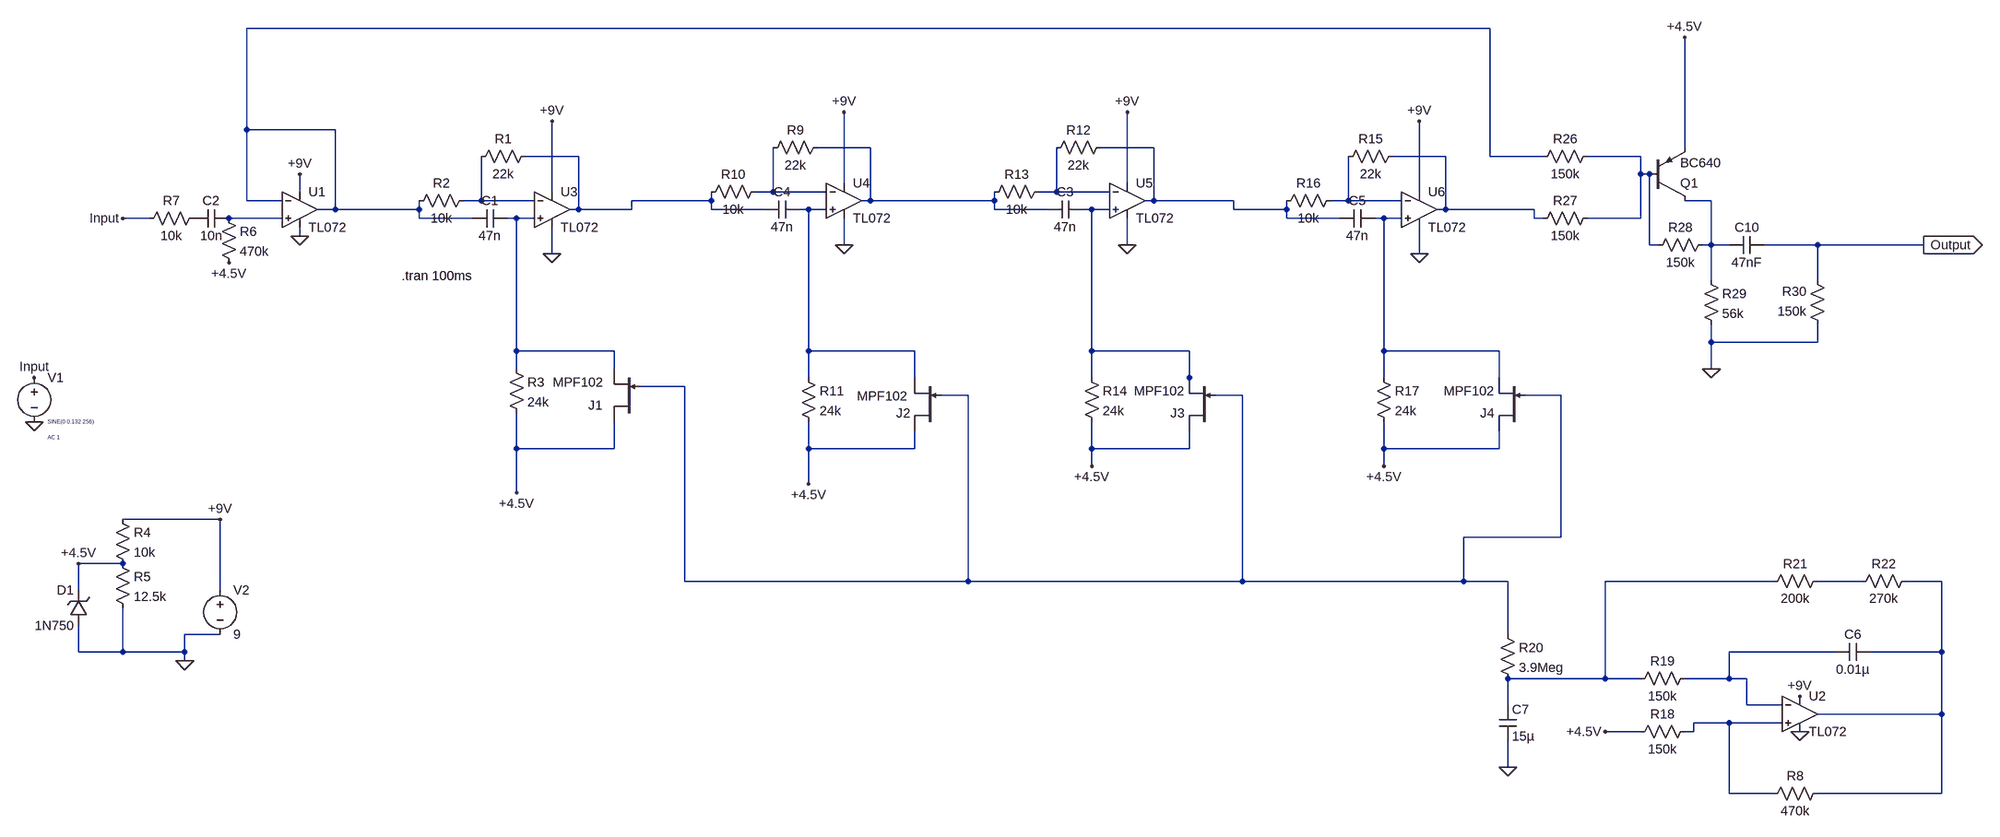
[diagram p0: schematic Phaser.asc]
Phaser.asc, the LTspice schematic file:
Version 4
SHEET 1 3668 1460
WIRE 1824 -176 -464 -176
WIRE -464 16 -464 -176
WIRE -304 16 -464 16
WIRE 704 48 608 48
WIRE 1216 48 1120 48
WIRE 2176 48 2176 -160
WIRE 176 64 80 64
WIRE 1744 64 1648 64
WIRE 1824 64 1824 -176
WIRE 1920 64 1824 64
WIRE 2096 64 2000 64
WIRE 2096 96 2096 64
WIRE 2112 96 2096 96
WIRE 656 112 656 -16
WIRE 1168 112 1168 -16
WIRE -368 128 -368 96
WIRE 128 128 128 0
WIRE 528 128 528 48
WIRE 528 128 496 128
WIRE 624 128 528 128
WIRE 1040 128 1040 48
WIRE 1040 128 1008 128
WIRE 1136 128 1040 128
WIRE 1696 128 1696 0
WIRE -464 144 -464 16
WIRE -400 144 -464 144
WIRE 0 144 0 64
WIRE 0 144 -32 144
WIRE 96 144 0 144
WIRE 416 144 416 128
WIRE 416 144 272 144
WIRE 704 144 704 48
WIRE 704 144 688 144
WIRE 928 144 928 128
WIRE 928 144 704 144
WIRE 1216 144 1216 48
WIRE 1216 144 1200 144
WIRE 1360 144 1216 144
WIRE 1568 144 1568 64
WIRE 1568 144 1536 144
WIRE 1664 144 1568 144
WIRE 2224 144 2176 144
WIRE -304 160 -304 16
WIRE -304 160 -336 160
WIRE -112 160 -112 144
WIRE -112 160 -304 160
WIRE 176 160 176 64
WIRE 176 160 160 160
WIRE 272 160 272 144
WIRE 272 160 176 160
WIRE 416 160 416 144
WIRE 512 160 416 160
WIRE 592 160 576 160
WIRE 624 160 592 160
WIRE 928 160 928 144
WIRE 1024 160 928 160
WIRE 1104 160 1088 160
WIRE 1136 160 1104 160
WIRE 1360 160 1360 144
WIRE 1456 160 1456 144
WIRE 1456 160 1360 160
WIRE 1744 160 1744 64
WIRE 1744 160 1728 160
WIRE 1904 160 1744 160
WIRE -640 176 -688 176
WIRE -400 176 -496 176
WIRE -112 176 -112 160
WIRE -16 176 -112 176
WIRE 64 176 48 176
WIRE 96 176 64 176
WIRE 1456 176 1456 160
WIRE 1552 176 1456 176
WIRE 1632 176 1616 176
WIRE 1664 176 1632 176
WIRE 1904 176 1904 160
WIRE 1920 176 1904 176
WIRE 2096 176 2096 96
WIRE 2096 176 2000 176
WIRE -368 208 -368 192
WIRE 656 224 656 176
WIRE 1168 224 1168 176
WIRE 2112 224 2112 96
WIRE 2128 224 2112 224
WIRE 2224 224 2224 144
WIRE 2224 224 2208 224
WIRE 2256 224 2224 224
WIRE 2416 224 2320 224
WIRE 2608 224 2416 224
WIRE 128 240 128 192
WIRE 1696 240 1696 192
WIRE 2224 288 2224 224
WIRE 2416 288 2416 224
WIRE 2224 400 2224 368
WIRE 2416 400 2416 368
WIRE 2416 400 2224 400
WIRE 64 416 64 176
WIRE 240 416 64 416
WIRE 592 416 592 160
WIRE 784 416 592 416
WIRE 1104 416 1104 160
WIRE 1280 416 1104 416
WIRE 1632 416 1632 176
WIRE 1840 416 1632 416
WIRE 64 448 64 416
WIRE 240 448 240 416
WIRE 2224 448 2224 400
WIRE 592 464 592 416
WIRE 784 464 784 416
WIRE 1104 464 1104 416
WIRE 1280 464 1280 416
WIRE 1632 464 1632 416
WIRE 1840 464 1840 416
WIRE 368 480 288 480
WIRE 1280 480 1280 464
WIRE 880 496 832 496
WIRE 1376 496 1328 496
WIRE 1952 496 1888 496
WIRE 64 592 64 528
WIRE 240 592 240 544
WIRE 240 592 64 592
WIRE 592 592 592 544
WIRE 784 592 784 560
WIRE 784 592 592 592
WIRE 1104 592 1104 544
WIRE 1280 592 1280 560
WIRE 1280 592 1104 592
WIRE 1632 592 1632 544
WIRE 1840 592 1840 560
WIRE 1840 592 1632 592
WIRE 1104 624 1104 592
WIRE 1632 624 1632 592
WIRE 592 656 592 592
WIRE 64 672 64 592
WIRE -512 720 -688 720
WIRE 1952 752 1952 496
WIRE 1952 752 1776 752
WIRE -688 800 -768 800
WIRE 368 832 368 480
WIRE 880 832 880 496
WIRE 880 832 368 832
WIRE 1376 832 1376 496
WIRE 1376 832 880 832
WIRE 1776 832 1776 752
WIRE 1776 832 1376 832
WIRE 1856 832 1776 832
WIRE 2336 832 2032 832
WIRE 2496 832 2416 832
WIRE 2640 832 2576 832
WIRE -768 848 -768 800
WIRE -512 848 -512 720
WIRE -512 928 -576 928
WIRE 1856 928 1856 832
WIRE -768 960 -768 912
WIRE -688 960 -688 880
WIRE -688 960 -768 960
WIRE -576 960 -576 928
WIRE -576 960 -688 960
WIRE 2448 960 2256 960
WIRE 2640 960 2640 832
WIRE 2640 960 2512 960
WIRE -576 976 -576 960
WIRE 2032 1008 2032 832
WIRE 2032 1008 1856 1008
WIRE 2096 1008 2032 1008
WIRE 2256 1008 2256 960
WIRE 2256 1008 2176 1008
WIRE 2288 1008 2256 1008
WIRE 1856 1056 1856 1008
WIRE 2288 1056 2288 1008
WIRE 2352 1056 2288 1056
WIRE 2640 1072 2640 960
WIRE 2640 1072 2416 1072
WIRE 2256 1088 2192 1088
WIRE 2352 1088 2256 1088
WIRE 2096 1104 2032 1104
WIRE 2192 1104 2192 1088
WIRE 2192 1104 2176 1104
WIRE 1856 1168 1856 1120
WIRE 2256 1216 2256 1088
WIRE 2336 1216 2256 1216
WIRE 2640 1216 2640 1072
WIRE 2640 1216 2416 1216
FLAG -576 976 0
FLAG 128 240 0
FLAG -848 544 0
FLAG -848 464 Input
FLAG -768 800 +4.5V
FLAG 64 672 +4.5V
FLAG 128 0 +9V
FLAG -512 720 +9V
FLAG -496 256 +4.5V
FLAG -368 96 +9V
FLAG -368 208 0
FLAG -688 176 Input
FLAG 656 224 0
FLAG 592 656 +4.5V
FLAG 656 -16 +9V
FLAG 1168 224 0
FLAG 1104 624 +4.5V
FLAG 1168 -16 +9V
FLAG 1696 240 0
FLAG 1632 624 +4.5V
FLAG 1696 0 +9V
FLAG 2224 448 0
FLAG 2176 -160 +4.5V
FLAG 2608 224 Output
IOPIN 2608 224 Out
FLAG 1856 1168 0
FLAG 2032 1104 +4.5V
FLAG 2384 1040 +9V
FLAG 2384 1104 0
SYMBOL res 96 48 R90
WINDOW 0 0 56 VBottom 2
WINDOW 3 32 56 VTop 2
SYMATTR InstName R1
SYMATTR Value 22k
SYMBOL res -16 128 R90
WINDOW 0 0 56 VBottom 2
WINDOW 3 32 56 VTop 2
SYMATTR InstName R2
SYMATTR Value 10k
SYMBOL voltage -848 448 R0
WINDOW 3 24 96 Left 0
WINDOW 123 24 124 Left 0
WINDOW 39 0 0 Left 0
SYMATTR Value SINE(0 0.132 256)
SYMATTR Value2 AC 1
SYMATTR InstName V1
SYMBOL voltage -512 832 R0
WINDOW 123 0 0 Left 0
WINDOW 39 0 0 Left 0
SYMATTR InstName V2
SYMATTR Value 9
SYMBOL cap 48 160 R90
WINDOW 0 0 32 VBottom 2
WINDOW 3 32 32 VTop 2
SYMATTR InstName C1
SYMATTR Value 47n
SYMBOL res -704 704 R0
SYMATTR InstName R4
SYMATTR Value 10k
SYMBOL res -704 784 R0
SYMATTR InstName R5
SYMATTR Value 12.5k
SYMBOL res 48 432 R0
SYMATTR InstName R3
SYMATTR Value 24k
SYMBOL cap -496 160 R90
WINDOW 0 0 32 VBottom 2
WINDOW 3 32 32 VTop 2
SYMATTR InstName C2
SYMATTR Value 10n
SYMBOL res -512 160 R0
SYMATTR InstName R6
SYMATTR Value 470k
SYMBOL res -544 160 R90
WINDOW 0 0 56 VBottom 2
WINDOW 3 32 56 VTop 2
SYMATTR InstName R7
SYMATTR Value 10k
SYMBOL res 624 32 R90
WINDOW 0 0 56 VBottom 2
WINDOW 3 32 56 VTop 2
SYMATTR InstName R9
SYMATTR Value 22k
SYMBOL res 512 112 R90
WINDOW 0 0 56 VBottom 2
WINDOW 3 32 56 VTop 2
SYMATTR InstName R10
SYMATTR Value 10k
SYMBOL cap 576 144 R90
WINDOW 0 0 32 VBottom 2
WINDOW 3 32 32 VTop 2
SYMATTR InstName C4
SYMATTR Value 47n
SYMBOL res 576 448 R0
SYMATTR InstName R11
SYMATTR Value 24k
SYMBOL res 1136 32 R90
WINDOW 0 0 56 VBottom 2
WINDOW 3 32 56 VTop 2
SYMATTR InstName R12
SYMATTR Value 22k
SYMBOL res 1024 112 R90
WINDOW 0 0 56 VBottom 2
WINDOW 3 32 56 VTop 2
SYMATTR InstName R13
SYMATTR Value 10k
SYMBOL cap 1088 144 R90
WINDOW 0 0 32 VBottom 2
WINDOW 3 32 32 VTop 2
SYMATTR InstName C3
SYMATTR Value 47n
SYMBOL res 1088 448 R0
SYMATTR InstName R14
SYMATTR Value 24k
SYMBOL res 1664 48 R90
WINDOW 0 0 56 VBottom 2
WINDOW 3 32 56 VTop 2
SYMATTR InstName R15
SYMATTR Value 22k
SYMBOL res 1552 128 R90
WINDOW 0 0 56 VBottom 2
WINDOW 3 32 56 VTop 2
SYMATTR InstName R16
SYMATTR Value 10k
SYMBOL cap 1616 160 R90
WINDOW 0 0 32 VBottom 2
WINDOW 3 32 32 VTop 2
SYMATTR InstName C5
SYMATTR Value 47n
SYMBOL res 1616 448 R0
SYMATTR InstName R17
SYMATTR Value 24k
SYMBOL TL072 -368 160 R0
SYMATTR InstName U1
SYMBOL TL072 128 160 R0
SYMATTR InstName U3
SYMBOL TL072 656 144 R0
SYMATTR InstName U4
SYMBOL TL072 1168 144 R0
SYMATTR InstName U5
SYMBOL TL072 1696 160 R0
SYMATTR InstName U6
SYMBOL res 2016 48 R90
WINDOW 0 0 56 VBottom 2
WINDOW 3 32 56 VTop 2
SYMATTR InstName R26
SYMATTR Value 150k
SYMBOL res 2016 160 R90
WINDOW 0 0 56 VBottom 2
WINDOW 3 32 56 VTop 2
SYMATTR InstName R27
SYMATTR Value 150k
SYMBOL pnp 2112 144 M180
SYMATTR InstName Q1
SYMATTR Value BC640
SYMBOL res 2224 208 R90
WINDOW 0 0 56 VBottom 2
WINDOW 3 32 56 VTop 2
SYMATTR InstName R28
SYMATTR Value 150k
SYMBOL cap 2320 208 R90
WINDOW 0 0 32 VBottom 2
WINDOW 3 32 32 VTop 2
SYMATTR InstName C10
SYMATTR Value 47nF
SYMBOL res 2208 272 R0
SYMATTR InstName R29
SYMATTR Value 56k
SYMBOL res 2432 384 R180
WINDOW 0 36 76 Left 2
WINDOW 3 36 40 Left 2
SYMATTR InstName R30
SYMATTR Value 150k
SYMBOL zener -752 912 R180
WINDOW 0 24 64 Left 2
WINDOW 3 24 0 Left 2
SYMATTR InstName D1
SYMATTR Value 1N750
SYMATTR Description Diode
SYMATTR Type diode
SYMBOL njf 288 544 R180
WINDOW 0 69 30 Left 2
WINDOW 3 67 72 Left 2
SYMATTR InstName J1
SYMATTR Value MPF102
SYMBOL njf 832 560 R180
WINDOW 3 61 63 Left 2
SYMATTR Value MPF102
SYMATTR InstName J2
SYMBOL njf 1328 560 R180
SYMATTR InstName J3
SYMATTR Value MPF102
SYMBOL njf 1888 560 R180
SYMATTR InstName J4
SYMATTR Value MPF102
SYMBOL TL072 2384 1072 R0
SYMATTR InstName U2
SYMBOL res 2432 1200 R90
WINDOW 0 0 56 VBottom 2
WINDOW 3 32 56 VTop 2
SYMATTR InstName R8
SYMATTR Value 470k
SYMBOL res 2192 1088 R90
WINDOW 0 0 56 VBottom 2
WINDOW 3 32 56 VTop 2
SYMATTR InstName R18
SYMATTR Value 150k
SYMBOL res 2192 992 R90
WINDOW 0 0 56 VBottom 2
WINDOW 3 32 56 VTop 2
SYMATTR InstName R19
SYMATTR Value 150k
SYMBOL res 1840 912 R0
SYMATTR InstName R20
SYMATTR Value 3.9Meg
SYMBOL res 2432 816 R90
WINDOW 0 0 56 VBottom 2
WINDOW 3 32 56 VTop 2
SYMATTR InstName R21
SYMATTR Value 200k
SYMBOL res 2592 816 R90
WINDOW 0 0 56 VBottom 2
WINDOW 3 32 56 VTop 2
SYMATTR InstName R22
SYMATTR Value 270k
SYMBOL cap 2512 944 R90
WINDOW 0 0 32 VBottom 2
WINDOW 3 32 32 VTop 2
SYMATTR InstName C6
SYMATTR Value 0.01µ
SYMBOL cap 1840 1056 R0
SYMATTR InstName C7
SYMATTR Value 15µ
TEXT -144 280 Left 2 !.tran 100ms

The netlist it stands for:
* Phaser.asc
R1 N004 N009 22k
R2 N009 N001 10k
V1 Input 0 SINE(0 0.132 256) AC 1
V2 +9V 0 9
C1 N015 N001 47n
R4 +9V +4.5V 10k
R5 +4.5V 0 12.5k
R3 N015 +4.5V 24k
C2 N014 P001 10n
R6 N014 +4.5V 470k
R7 P001 Input 10k
R9 N002 N007 22k
R10 N007 N004 10k
C4 N012 N004 47n
R11 N012 +4.5V 24k
R12 N003 N008 22k
R13 N008 N002 10k
C3 N013 N002 47n
R14 N013 +4.5V 24k
R15 N005 N010 22k
R16 N010 N003 10k
C5 N016 N003 47n
R17 N016 +4.5V 24k
* U1: TL072 (symbol TL072 not available, pins judged from their places): In+=N014 In-=N001 V+=+9V V-=0 OUT=N001
* U3: TL072 (symbol TL072 not available, pins judged from their places): In+=N015 In-=N009 V+=+9V V-=0 OUT=N004
* U4: TL072 (symbol TL072 not available, pins judged from their places): In+=N012 In-=N007 V+=+9V V-=0 OUT=N002
* U5: TL072 (symbol TL072 not available, pins judged from their places): In+=N013 In-=N008 V+=+9V V-=0 OUT=N003
* U6: TL072 (symbol TL072 not available, pins judged from their places): In+=N016 In-=N010 V+=+9V V-=0 OUT=N005
R26 N006 N001 150k
R27 N006 N005 150k
Q1 N011 N006 +4.5V 0 BC640
R28 N011 N006 150k
C10 Output N011 47nF
R29 N011 0 56k
R30 0 Output 150k
D1 0 +4.5V 1N750
J1 +4.5V N017 N015 MPF102
J2 +4.5V N017 N012 MPF102
J3 +4.5V N017 N013 MPF102
J4 +4.5V N017 N016 MPF102
* U2: TL072 (symbol TL072 not available, pins judged from their places): In+=N022 In-=N021 V+=+9V V-=0 OUT=N020
R8 N020 N022 470k
R18 N022 +4.5V 150k
R19 N021 N018 150k
R20 N017 N018 3.9Meg
R21 N019 N018 200k
R22 N020 N019 270k
C6 N020 N021 0.01µ
C7 N018 0 15µ
.model D D
.lib standard.dio
.model NPN NPN
.model PNP PNP
.lib standard.bjt
.model NJF NJF
.model PJF PJF
.lib standard.jft
.tran 100ms
.backanno
.end